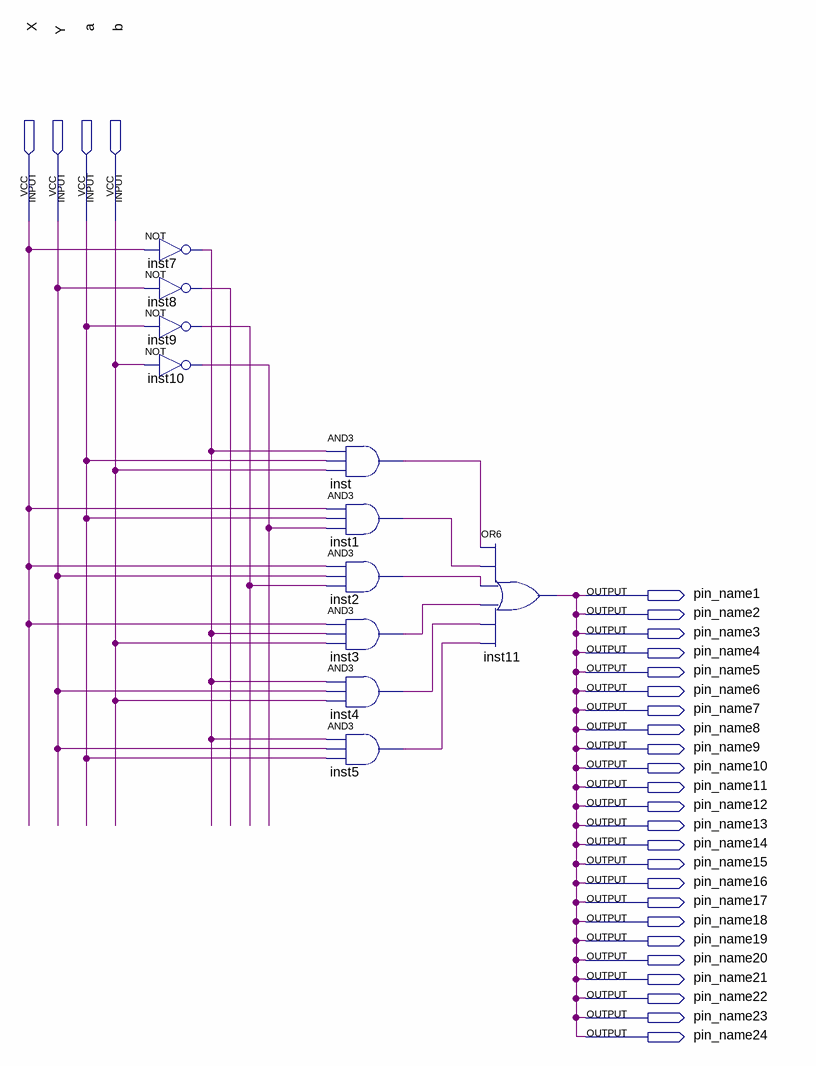
[diagram p0: schematic sheet]
// Quartus schematic lab6.bdf as structural Verilog: 11 symbols, 28 pins
module lab6 (
  input  X,
  input  Y,
  input  a,
  input  b,
  output pin_name1,
  output pin_name2,
  output pin_name3,
  output pin_name4,
  output pin_name5,
  output pin_name6,
  output pin_name7,
  output pin_name8,
  output pin_name9,
  output pin_name10,
  output pin_name11,
  output pin_name12,
  output pin_name13,
  output pin_name14,
  output pin_name15,
  output pin_name16,
  output pin_name17,
  output pin_name18,
  output pin_name19,
  output pin_name20,
  output pin_name21,
  output pin_name22,
  output pin_name23,
  output pin_name24
);

  wire inst1_out, inst2_out, inst3_out, inst4_out, inst5_out, inst7_out, inst8_out, inst9_out, inst10_out,
       inst_out;

  not inst7 (inst7_out, X);
  not inst8 (inst8_out, Y);
  not inst9 (inst9_out, a);
  not inst10 (inst10_out, b);
  and inst (inst_out, inst7_out, a, b);
  and inst1 (inst1_out, X, a, inst10_out);
  and inst2 (inst2_out, X, Y, inst9_out);
  and inst3 (inst3_out, X, inst7_out, b);
  and inst4 (inst4_out, inst7_out, Y, b);
  and inst5 (inst5_out, inst7_out, Y, a);
  or inst11 (pin_name1, inst_out, inst1_out, inst2_out, inst3_out, inst4_out, inst5_out);

  assign pin_name2 = pin_name1;
  assign pin_name3 = pin_name1;
  assign pin_name4 = pin_name1;
  assign pin_name5 = pin_name1;
  assign pin_name6 = pin_name1;
  assign pin_name7 = pin_name1;
  assign pin_name8 = pin_name1;
  assign pin_name9 = pin_name1;
  assign pin_name10 = pin_name1;
  assign pin_name11 = pin_name1;
  assign pin_name12 = pin_name1;
  assign pin_name13 = pin_name1;
  assign pin_name14 = pin_name1;
  assign pin_name15 = pin_name1;
  assign pin_name16 = pin_name1;
  assign pin_name17 = pin_name1;
  assign pin_name18 = pin_name1;
  assign pin_name19 = pin_name1;
  assign pin_name20 = pin_name1;
  assign pin_name21 = pin_name1;
  assign pin_name22 = pin_name1;
  assign pin_name23 = pin_name1;
  assign pin_name24 = pin_name1;
endmodule
